# Altium schematic sheet ESP32-S3-STD2.SchDoc
size A4; SheetNumber: 1; SheetTotal: 1
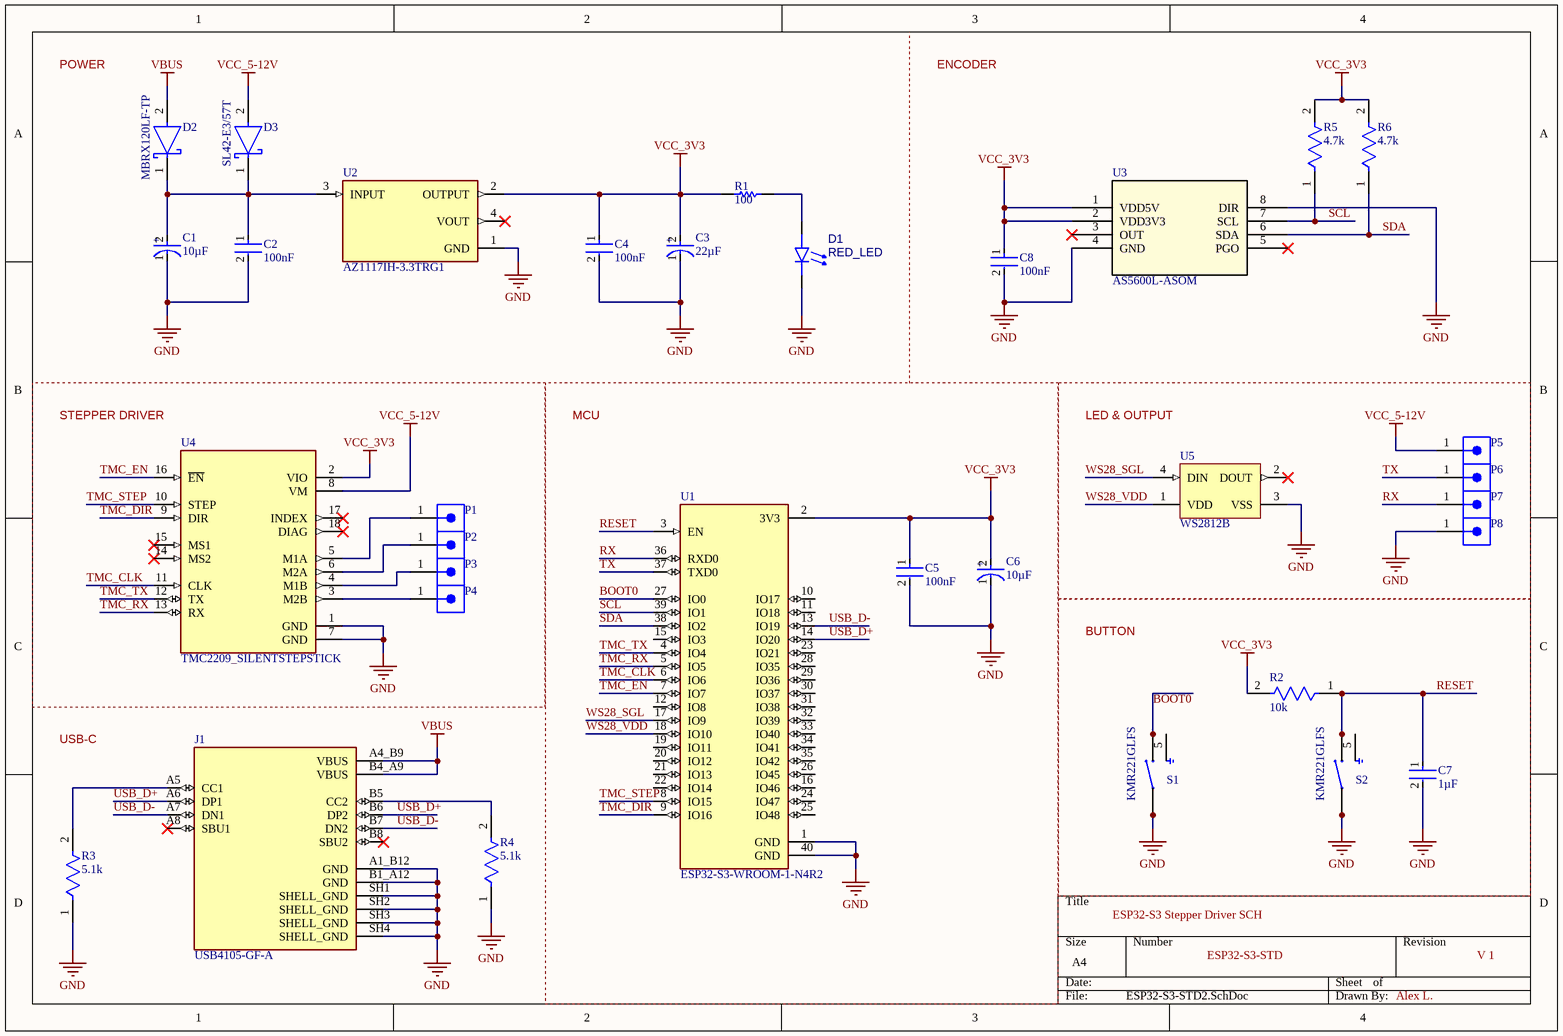
[diagram p0: ESP32-S3-STD2.SchDoc]

## Parts
C1  value 10µF  [FP-FKB-MFG]  (hidden comment: EEE-FK1C100R)
C2  value 100nF  [FP-C1206C-EB-MFG]  (hidden comment: C1206C104K5RAC7210)
C3  value 22µF  [FP-FKC-MFG]  (hidden comment: EEE-FK1V220R)
C4  value 100nF  [FP-C1206C-EB-MFG]  (hidden comment: C1206C104K5RAC7210)
C5  value 100nF  [FP-C1206C-EB-MFG]  (hidden comment: C1206C104K5RAC7210)
C6  value 10µF  [FP-FKB-MFG]  (hidden comment: EEE-FK1C100R)
C7  value 1µF  [FP-CL31-IPC_C]  (hidden comment: CL31B105KOFNNNE)
C8  value 100nF  [FP-C1206C-EB-MFG]  (hidden comment: C1206C104K5RAC7210)
D1  RED_LED  [LITE-ON-LTST-C191KRKT-2_V]
D2  MBRX120LF-TP  [FP-SOD-123-IPC_B]
D3  SL42-E3/57T  [FP-95402-MFG]
J1  USB4105-GF-A  [GCT_USB4105-GF-A]
P1  61300111121  [61300111121]  (value not drawn)
P2  61300111121  [61300111121]  (value not drawn)
P3  61300111121  [61300111121]  (value not drawn)
P4  61300111121  [61300111121]  (value not drawn)
P5  61300111121  [61300111121]  (value not drawn)
P6  61300111121  [61300111121]  (value not drawn)
P7  61300111121  [61300111121]  (value not drawn)
P8  61300111121  [61300111121]  (value not drawn)
R1  value 100  [RESC3216X70X50NL05T20]  (hidden comment: ERJ-8ENF1000V)
R2  value 10k  [FP-RMCF1206-IPC_B]  (hidden comment: RMCF1206FT10K0)
R3  value 5.1k  [FP-RMCF1206-IPC_B]  (hidden comment: RMCF1206JT5K10)
R4  value 5.1k  [FP-RMCF1206-IPC_B]  (hidden comment: RMCF1206JT5K10)
R5  value 4.7k  [FP-RMCF1206-IPC_B]  (hidden comment: RMCF1206JT4K70)
R6  value 4.7k  [FP-RMCF1206-IPC_B]  (hidden comment: RMCF1206JT4K70)
S1  KMR221GLFS  [SW_KMR221GLFS]
S2  KMR221GLFS  [SW_KMR221GLFS]
U1  ESP32-S3-WROOM-1-N4R2  [XCVR_ESP32-S3-WROOM-1-N4R2]
U2  AZ1117IH-3.3TRG1  [SOT230P700X185-4N]
U3  AS5600L-ASOM  [SOIC127P600X175-8N]
U4  TMC2209_SILENTSTEPSTICK  [MODULE_TMC2209_SILENTSTEPSTICK]
U5  WS2812B  [ADA-RGB-1655_V]

## Blocks framed on the sheet
STEPPER DRIVER: P1-P4 U4
MCU: C5 C6 U1
LED & OUTPUT: P5-P8 U5
BUTTON: C7 R2 S1 S2

## Nets
GND: C1.1(C) C2.2 C3.1(C) C4.2 C5.2 C6.1(C) C7.2 C8.2 D1.1(K) J1.A1_B12(GND) J1.B1_A12(GND) J1.SH1(SHELL_GND) J1.SH2(SHELL_GND) J1.SH3(SHELL_GND) J1.SH4(SHELL_GND) P8.1 R3.1 R4.1 S1.1 S1.4 S2.1 S2.4 U1.1(GND) U1.40(GND) U2.1(GND) U3.4(GND) U3.8(DIR) U4.1(GND) U4.7(GND) U5.3(VSS)
VBUS: D2.2(A) J1.A4_B9(VBUS) J1.B4_A9(VBUS)
VCC_3V3: C3.2(A) C4.1 C5.1 C6.2(A) C8.1 R1.1 R2.2 R5.2 R6.2 U1.2(3V3) U2.2(OUTPUT) U3.1(VDD5V) U3.2(VDD3V3) U4.2(VIO)
VCC_5-12V: D3.2(A) P5.1 U4.8(VM)
BOOT0: S1.2 S1.3 U1.27(IO0)
RESET: C7.1 R2.1 S2.2 S2.3 U1.3(EN)
RX: P7.1 U1.36(RXD0)
SCL: R5.1 U1.39(IO1) U3.7(SCL)
SDA: R6.1 U1.38(IO2) U3.6(SDA)
TMC_CLK: U1.6(IO6) U4.11(CLK)
TMC_DIR: U1.9(IO16) U4.9(DIR)
TMC_EN: U1.7(IO7) U4.16(~{EN})
TMC_RX: U1.5(IO5) U4.13(RX)
TMC_STEP: U1.8(IO15) U4.10(STEP)
TMC_TX: U1.4(IO4) U4.12(TX)
TX: P6.1 U1.37(TXD0)
USB_D+: J1.A6(DP1) J1.B6(DP2) U1.14(IO20)
USB_D-: J1.A7(DN1) J1.B7(DN2) U1.13(IO19)
WS28_SGL: U1.17(IO9) U5.4(DIN)
WS28_VDD: U1.18(IO10) U5.1(VDD)
NetC1_2: C1.2(A) C2.1 D2.1(C) D3.1(C) U2.3(INPUT)
NetD1_2: D1.2(A) R1.2
NetJ1_A5: J1.A5(CC1) R3.2
NetJ1_B5: J1.B5(CC2) R4.2
NetP1_1: P1.1 U4.5(M1A)
NetP2_1: P2.1 U4.6(M2A)
NetP3_1: P3.1 U4.4(M1B)
NetP4_1: P4.1 U4.3(M2B)

Not connected (* = marked no-connect by the designer): J1 A8(SBU1)* B8(SBU2)*; S1 5; S2 5; U1 10(IO17) 11(IO18) 12(IO8) 15(IO3) 16(IO46) 19(IO11) 20(IO12) 21(IO13) 22(IO14) 23(IO21) 24(IO47) 25(IO48) 26(IO45) 28(IO35) 29(IO36) 30(IO37) 31(IO38) 32(IO39) 33(IO40) 34(IO41) 35(IO42); U2 4(VOUT)*; U3 3(OUT)* 5(PGO)*; U4 14(MS2)* 15(MS1)* 17(INDEX)* 18(DIAG)*; U5 2(DOUT)*

## Notes on the sheet
- POWER
- ENCODER
- USB-C
- ESP32-S3 Stepper Driver SCH
- ESP32-S3-STD
- V 1
- Alex L.
- (in symbol CMP-001-00083-1) +
- (in symbol CMP-001-00084-1) +

## Library data of the parts
C1 C6 = CMP-001-00083-1: Aluminum Electrolytic Capacitor, Polarized, Aluminum (wet), 16V, 20% +Tol, 20% -Tol, 10uF, Surface Mount, 1717; Capacitor Type: Aluminium; Ripple Current: 67.5mA; Case/Package: 1717; RoHS Compliant: Yes; Max Operating Temperature: 105°C; Min Operating Temperature: -55°C; Mounting Technology: Surface Mount; Pins: 2
C2 C4 C5 C8 = CMP-001-00085-1: Ceramic Capacitor, Multilayer, Ceramic, 50V, 10% +Tol, 10% -Tol, X7R, 15% TC, 0.1uF, Surface Mount, 1206; Mounting Technology: Surface Mount; Pins: 2; Capacitor Type: Ceramic; Min Operating Temperature: -55°C; RoHS Compliant: Yes; Max Operating Temperature: 125°C; Case/Package: 1206
C3 = CMP-001-00084-1: Aluminum Electrolytic Capacitor, Polarized, Aluminum (wet), 35V, 20% +Tol, 20% -Tol, 22uF, Surface Mount, 2121; Capacitor Type: Aluminium; Ripple Current: 120mA; Mounting Technology: Surface Mount; Case/Package: 2121; Min Operating Temperature: -55°C; Max Operating Temperature: 105°C; RoHS Compliant: Yes; Pins: 2
C7 = CMP-001-00086-1: Ceramic Capacitor, Multilayer, Ceramic, 16V, 10% +Tol, 10% -Tol, X7R, 15% TC, 1uF, Surface Mount, 1206; Case/Package: 1206; Min Operating Temperature: -55°C; RoHS Compliant: Yes; Max Operating Temperature: 125°C; Capacitor Type: Ceramic; Pins: 2; Mounting Technology: Surface Mount
D1 = CMP-007-00036-1: Single Color LED, Red, Water Clear, 1.1mm; Forward Voltage: 2.4V; Forward Current: 30mA; Min Operating Temperature: -55°C; RoHS Compliant: Yes; Mounting Technology: Surface Mount; Max Operating Temperature: 85°C; Pins: 2
D2 = CMP-004-00031-1: Rectifier Diode, Schottky, 1 Phase, 1 Element, 1A, 20V V(RRM), Silicon; Forward Voltage: 360mV; RoHS Compliant: Yes; Max Operating Temperature: 125°C; Min Operating Temperature: -65°C; Pins: 2
D3 = CMP-004-00032-1: Rectifier Diode, Schottky, 1 Phase, 1 Element, 4A, 20V V(RRM), Silicon, DO-214AB; Forward Voltage: 310mV; Max Operating Temperature: 125°C; Pins: 2; Min Operating Temperature: -55°C; RoHS Compliant: Yes
J1 = USB4105-GF-A: USB-C (USB TYPE-C) USB 2.0 Receptacle Connector 24 (16+8 Dummy) Position Surface Mount, Right Angle; Through Hole; MF: GCT; SnapEDA_Link: https://www.snapeda.com/parts/USB4105-GF-A/Global+Connector+Technology/view-part/?ref=snap; Package: None; Value: *; MP: USB4105-GF-A; Check_prices: https://www.snapeda.com/parts/USB4105-GF-A/Global+Connector+Technology/view-part/?ref=eda
P1-P8 = CMP-002-00079-1: Board Connector, 1 Contact(s), 1 Row(s), Male, Straight, 0.1 inch Pitch, Solder Terminal, Locking, Black Insulator, Plug; Connector Type: BOARD CONNECTOR; RoHS Compliant: Yes; Mounting Technology: Board; Min Operating Temperature: -40°C; Max Operating Temperature: 125°C
R1 = CMP-009-00179-1: Fixed Resistor, Metal Glaze/thick Film, 0.25W, 100ohm, 200V, 1% +/-Tol, 100ppm/Cel, Surface Mount, 1206; Power: 250mW; Mounting Technology: Surface Mount; Min Operating Temperature: -55°C; Max Operating Temperature: 155°C; RoHS Compliant: Yes; Pins: 2; Tolerance: 1%; Case/Package: 1206
R2 = CMP-009-00180-1: Fixed Resistor, Metal Glaze/thick Film, 0.25W, 10000ohm, 200V, 1% +/-Tol, 100ppm/Cel, Surface Mount, 1206; Power: 250mW; Min Operating Temperature: -55°C; Mounting Technology: Surface Mount; Pins: 2; Max Operating Temperature: 155°C; Case/Package: 1206; Tolerance: 1%; RoHS Compliant: Yes
R3 R4 = CMP-009-00182-1: Fixed Resistor, Metal Glaze/thick Film, 0.25W, 5100ohm, 200V, 5% +/-Tol, 200ppm/Cel, Surface Mount, 1206; Power: 250mW; Max Operating Temperature: 155°C; Mounting Technology: Surface Mount; Pins: 2; Tolerance: 5%; Case/Package: 1206; RoHS Compliant: Yes; Min Operating Temperature: -55°C
R5 R6 = CMP-009-00183-1: Fixed Resistor, Metal Glaze/thick Film, 0.25W, 4700ohm, 200V, 5% +/-Tol, 200ppm/Cel, Surface Mount, 1206; Power: 250mW; RoHS Compliant: Yes; Mounting Technology: Surface Mount; Pins: 2; Tolerance: 5%; Max Operating Temperature: 155°C; Min Operating Temperature: -55°C; Case/Package: 1206
S1 S2 = KMR221GLFS: Switch Tactile N.O. SPST Button Gull Wing 0.05A 32VDC 1VA 200000Cycles 2N SMD Automotive T/R; Price: None; Value: *; Package: None; Availability: Unavailable; MP: KMR221GLFS
U1 = ESP32-S3-WROOM-1-N4R2: Bluetooth, WiFi 802.11b/g/n, Bluetooth v5.0 Transceiver Module 2.4GHz PCB Trace Surface Mount; MF: Espressif Systems; Package: None; Purchase-URL: https://pricing.snapeda.com/search/part/ESP32-S3-WROOM-1-N4R2/?ref=eda; Price: None; Availability: In Stock; Check_prices: https://www.snapeda.com/parts/ESP32-S3-WROOM-1-N4R2/Espressif+Systems/view-part/?ref=eda; MP: ESP32-S3-WROOM-1-N4R2; SnapEDA_Link: https://www.snapeda.com/parts/ESP32-S3-WROOM-1-N4R2/Espressif+Systems/view-part/?ref=snap; Value: *
U2 = AZ1117IH-3.3TRG1: Linear Voltage Regulator IC Positive Fixed 1 Output 1A SOT-223-3; MF: Diodes Inc.; Check_prices: https://www.snapeda.com/parts/AZ1117IH-3.3TRG1/Diodes+Inc./view-part/?ref=eda; Value: *; Availability: In Stock; MP: AZ1117IH-3.3TRG1; Price: None; Package: SOT-223 Diodes Inc.; SnapEDA_Link: https://www.snapeda.com/parts/AZ1117IH-3.3TRG1/Diodes+Inc./view-part/?ref=snap; Purchase-URL: https://pricing.snapeda.com/search/part/AZ1117IH-3.3TRG1/?ref=eda
U3 = AS5600L-ASOM: No Description Available; Mfr_Name: AMS; Copyright: Copyright (C) 2023 Ultra Librarian. All rights reserved.; Manufacturer_Part_Number: AS5600L-ASOM; RefDes: RefDes; Type: DEV
U4 = TMC2209_SILENTSTEPSTICK: TMC2209 Motor Controller/Driver Power Management Evaluation Board; MP: TMC2209 SILENTSTEPSTICK; MF: Trinamic Motion Control GmbH; Check_prices: https://www.snapeda.com/parts/TMC2209%20SILENTSTEPSTICK/Trinamic+Motion+Control+GmbH/view-part/?ref=eda; Price: None; SnapEDA_Link: https://www.snapeda.com/parts/TMC2209%20SILENTSTEPSTICK/Trinamic+Motion+Control+GmbH/view-part/?ref=snap; Availability: In Stock; Value: *; Purchase-URL: https://pricing.snapeda.com/search/part/TMC2209 SILENTSTEPSTICK/?ref=eda; Package: None
U5 = CMP-007-00037-1: WS2812B 5050 RGB LED WITH INTEGRATED DRIVER CHIP PACK OF 10